# Altium project Temperature sensor_Thermodeep.PrjPcb
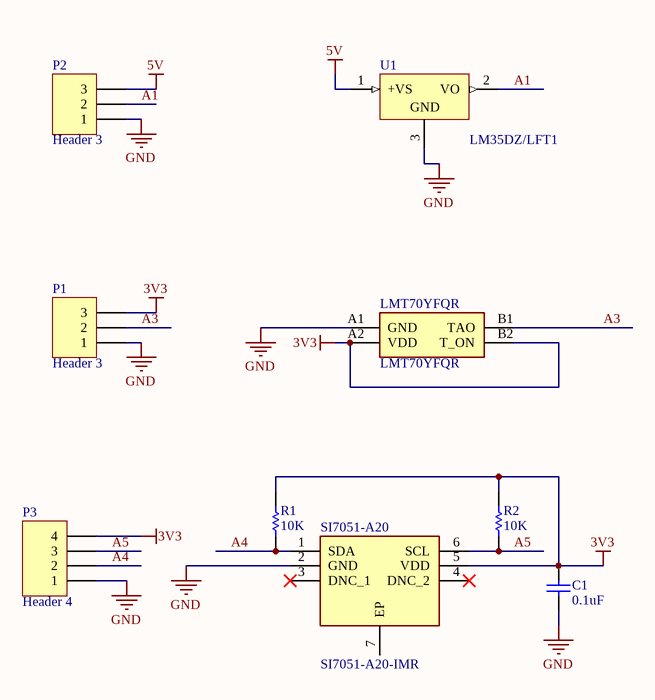
[diagram p0: Sensors.SchDoc]
1 sheet, 9 parts. Net scope: global (net labels, ports and power ports of the same name join across sheets).
Board files: LM35.PcbDoc, LMT70YFQR.PcbDoc, Panel_Sensores.PcbDoc, SI7051-A20.PcbDoc

## Sheet Sensors.SchDoc: TermoDeep Sensors
size A4; Proyect DSD: Termodeep; Version: V 1.0  Rev A

### Parts
C1  0.1uF  [C0603_L]
LMT70YFQR  LMT70YFQR  [BGA4C40P2X2_88X88X68]
P1  Header 3  [HDR1X3]
P2  Header 3  [HDR1X3]
P3  Header 4  [HDR1X4]
R1  10K  [R0603_L]
R2  10K  [R0603_L]
SI7051-A20  SI7051-A20-IMR  [SON100P300X300X80-7N-D]
U1  LM35DZ/LFT1  [Z03A]

### Nets
3V3: C1.2 LMT70YFQR.A2(VDD) LMT70YFQR.B2(T_ON) P1.3 P3.4 R1.2 R2.2 SI7051-A20.5(VDD)
5V: P2.3 U1.1(+VS)
GND: C1.1 LMT70YFQR.A1(GND) P1.1 P2.1 P3.1 SI7051-A20.2(GND) U1.3(GND)
A1: P2.2 U1.2(VO)
A3: LMT70YFQR.B1(TAO) P1.2
A4: P3.2 R1.1 SI7051-A20.1(SDA)
A5: P3.3 R2.1 SI7051-A20.6(SCL)

Not connected (* = marked no-connect by the designer): SI7051-A20 3(DNC_1)* 4(DNC_2)* 7(EP)

### Notes on the sheet
- Title
- Size:
- Date:
- A4
- Version
- Sheet
- of
- DeepSea Developments
- Cll  2A # 24C - 25
- Cali, Valle del Cauca
- Colombia
- www.dsd.dev
- Proyect:

### Library data of the parts
C1 = C_SMD: Value: 0.1uF
LMT70YFQR = LMT70YFQR: Integrated Circuit; Manufacturer_Name: Texas Instruments; Datasheet Link: http://www.ti.com/lit/gpn/lmt70; Height: 0.675mm; Manufacturer_Part_Number: LMT70YFQR; Arrow Part Number: LMT70YFQR; Arrow Price/Stock: https://www.arrow.com/en/products/lmt70yfqr/texas-instruments; Mouser Part Number: 595-LMT70YFQR; Mouser Price/Stock: https://www.mouser.co.uk/ProductDetail/Texas-Instruments/LMT70YFQR?qs=jpHf3Ogds1xPpU553AtQFw%3D%3D
P1 P2 = Header 3: Header, 3-Pin; LatestRevisionDate: 17-Jul-2002; LatestRevisionNote: Re-released for DXP Platform.; Publisher: Altium Limited
P3 = Header 4: Header, 4-Pin; LatestRevisionDate: 17-Jul-2002; LatestRevisionNote: Re-released for DXP Platform.; Publisher: Altium Limited
R1 R2 = R_SMD: Value: 10K
SI7051-A20 = SI7051-A20-IMR: Integrated Circuit; Manufacturer_Name: Silicon Labs; Datasheet Link: https://componentsearchengine.com/Datasheets/1/SI7051-A20-IMR.pdf; Height: 0.8mm; Manufacturer_Part_Number: SI7051-A20-IMR; Arrow Part Number: SI7051-A20-IMR; Arrow Price/Stock: https://www.arrow.com/en/products/si7051-a20-imr/silicon-labs; Mouser Part Number: 634-SI7051-A20-IMR; Mouser Price/Stock: https://www.mouser.co.uk/ProductDetail/Silicon-Labs/SI7051-A20-IMR?qs=j6MGy4L9yX2zSJWGGFfXqQ%3D%3D
U1 = LM35DZ/LFT1: IC SENSOR PREC CENT TEMP TO92-3; Manufacturer: Texas Instruments; Sensing Temperature: 0°C ~ 100°C; Output Type: Linear Voltage; Voltage - Supply: 4 V ~ 30 V; Accuracy: ±0.6°C; Supplier 1: Digi-Key; RoHS: RoHS Compliant; Category: Sensors, Transducers; Stock 1: 630; Pricing 1: 1=1.57, 10=1.392, 25=1.2572, 100=1.1001, 250=0.96536, 500=0.8531, 1000=0.6735, 2500=0.6286, 5000=0.59717 (USD); Packaging: Bulk; Package / Case: TO-226-3, TO-92-3 (TO-226AA); Supplier Device Package: TO-92-3; ComponentLink1URL: http://www.ti.com/lit/ds/symlink/lm35.pdf; ComponentLink1Description: http://www.ti.com/lit/ds/symlink/lm35.pdf; Supplier Part Number 1: 296-35151-ND; Manufacturer Part Number: LM35DZ/LFT1